# EAGLE schematic mimic1568_DtoA (EAGLE 7.5.0)
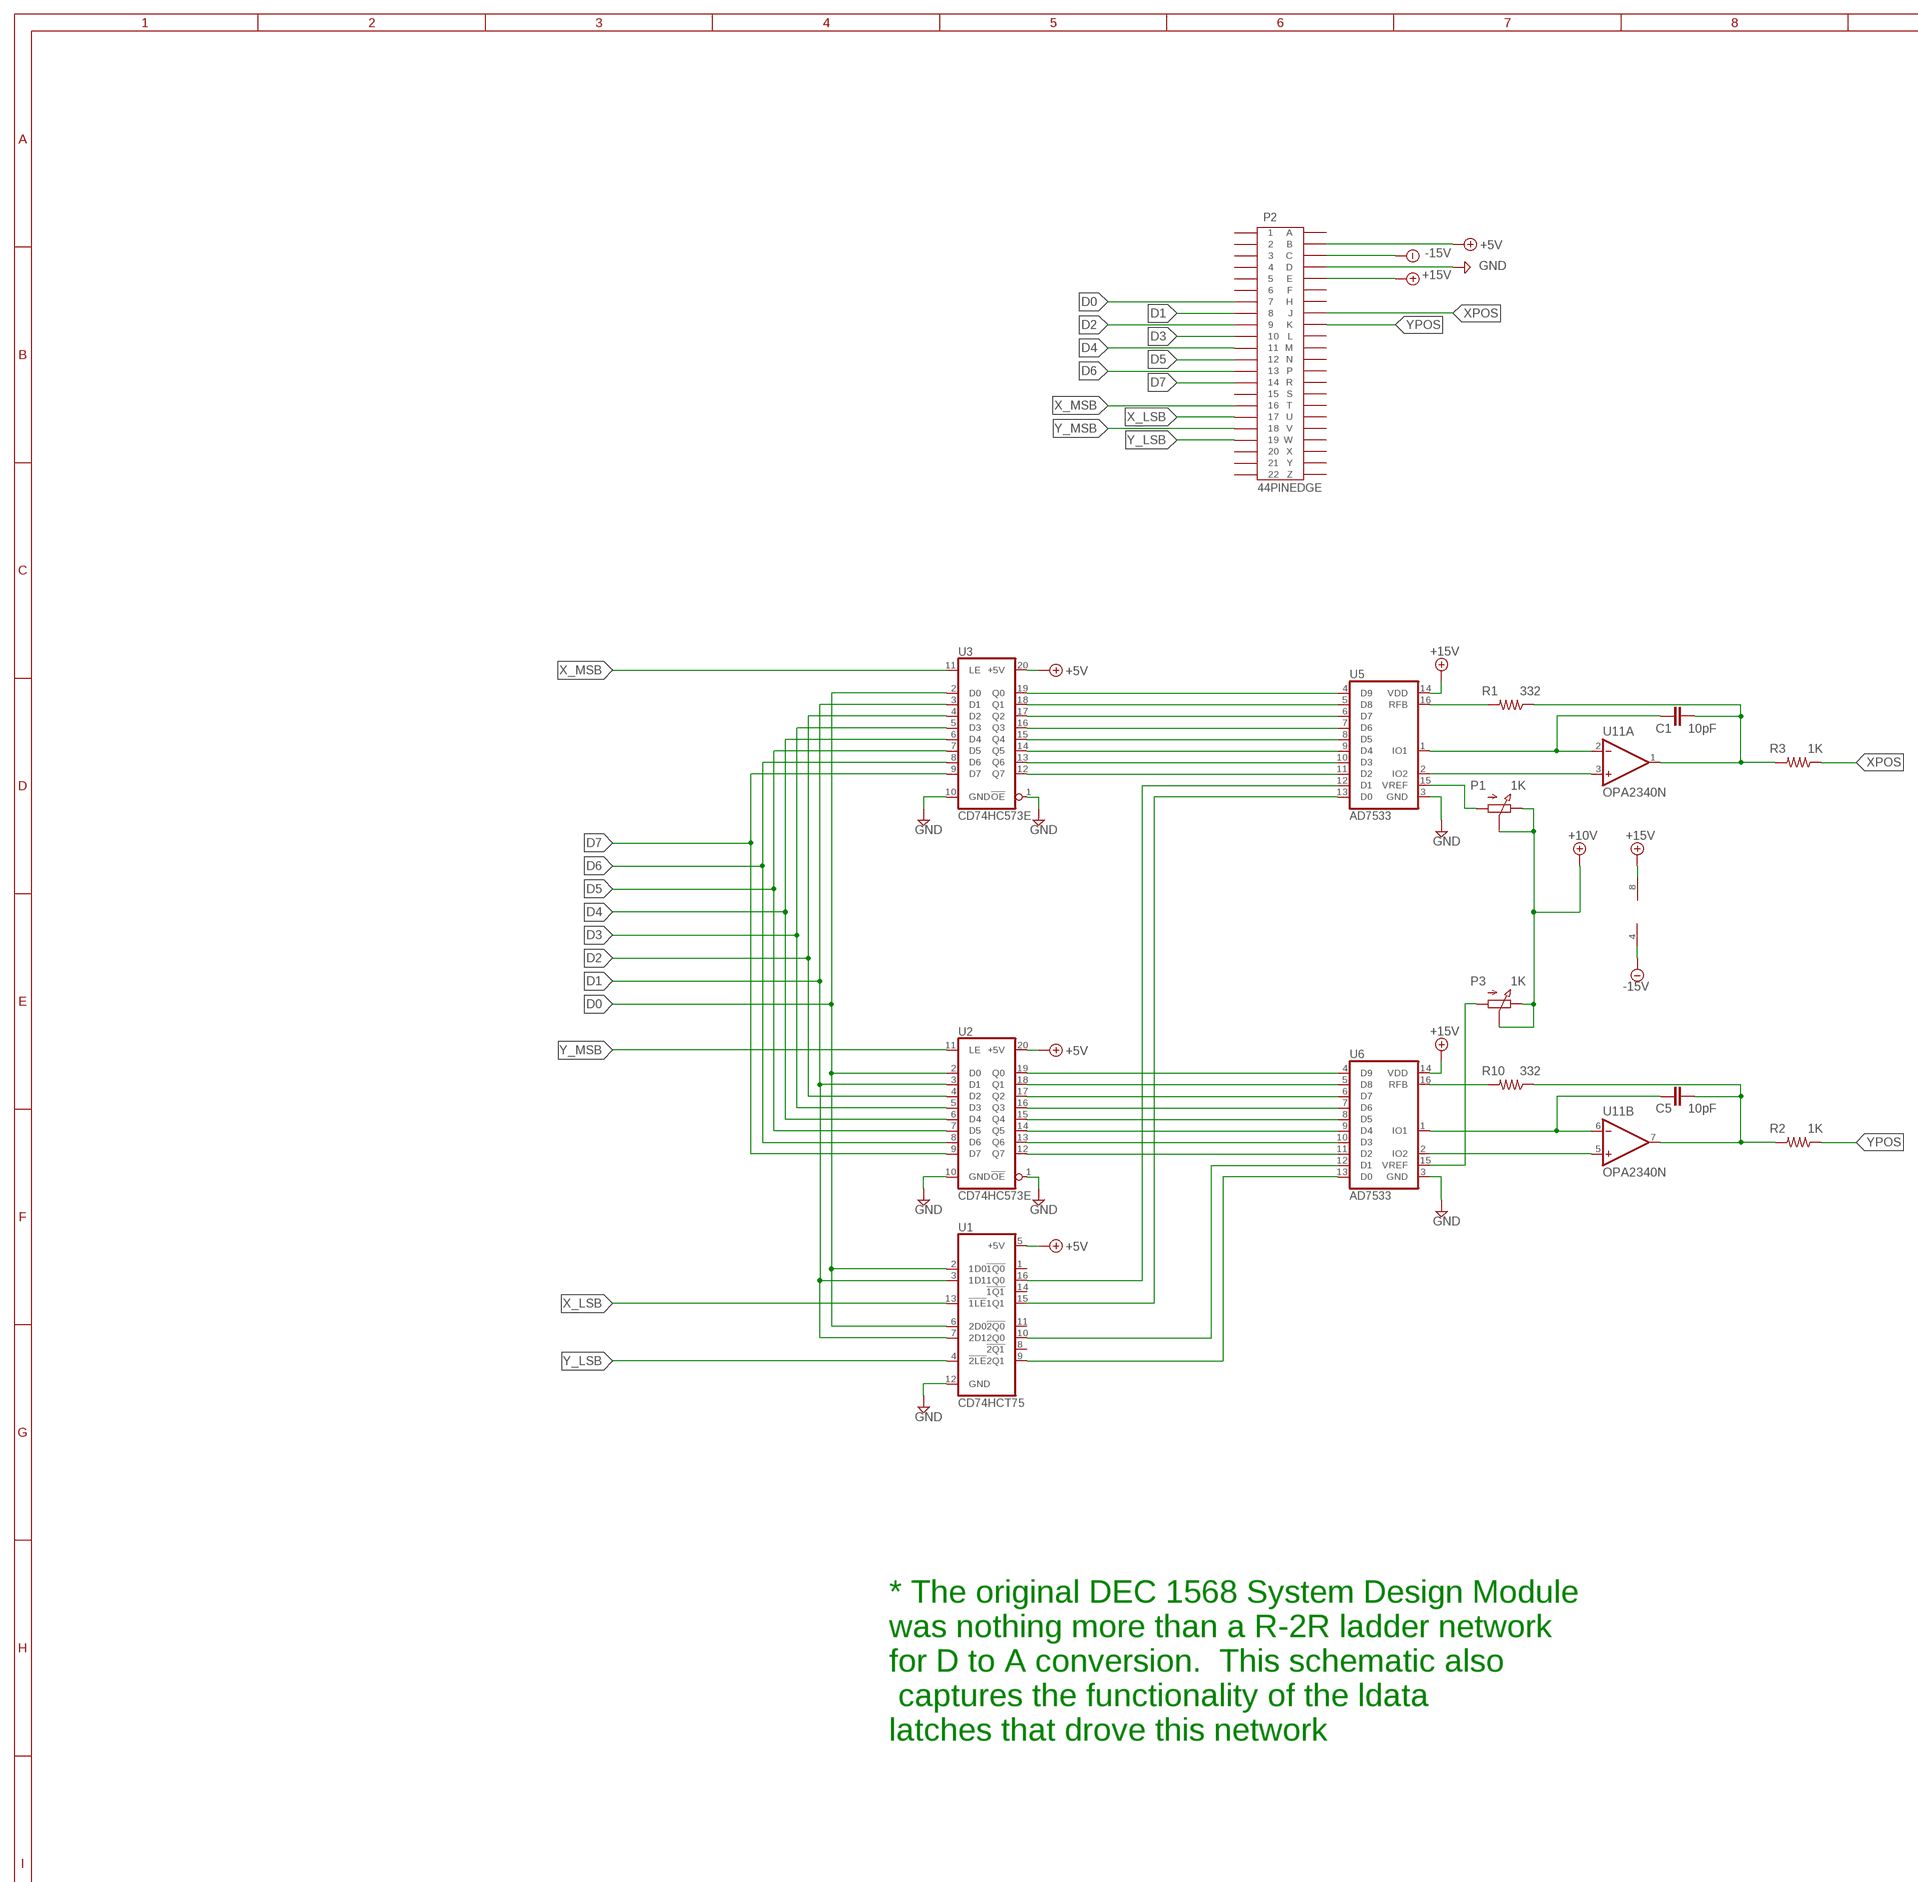
[diagram p0: schematic, sheet 1, part 1 of 2]
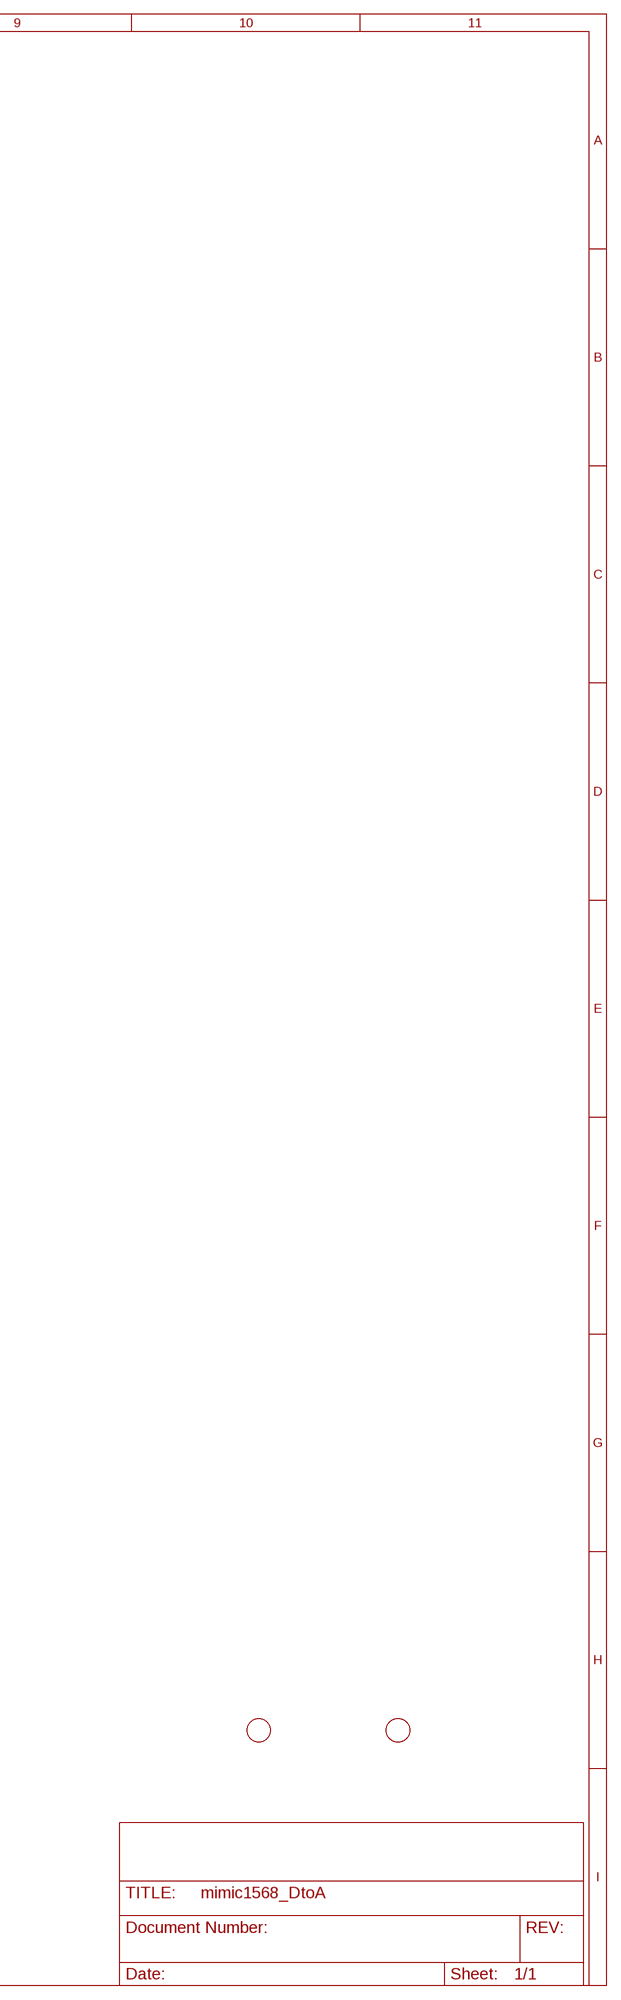
[diagram p1: schematic, sheet 1, part 2 of 2]

## Parts
C1  10pF  C-0.1  [C2.5]
C5  10pF  C-0.1  [C2.5]
P1  1K  POT-3006P  [3006P]
P2  44PINEDGE  [44PINEDGE]
P3  1K  POT-3006P  [3006P]
R1  332  R-1/4WATT  [0207/10]
R2  1K  R-1/4WATT  [0207/10]
R3  1K  R-1/4WATT  [0207/10]
R10  332  R-1/4WATT  [0207/10]
U1  CD74HCT75  [DIP-16]
U2  CD74HC573E  [DIP-20]
U3  CD74HC573E  [DIP-20]
U5  AD7533  [DIP-16]
U6  AD7533  [DIP-16]
U11  OPA2340N  [DIP-08]
U$1  FIDUCIAL  [FIDUCIAL_1MM]
U$2  FIDUCIAL  [FIDUCIAL_1MM]

## Nets
+5V: P2.B U1.5(+5V) U2.20(+5V) U3.20(+5V)
+10V: P1.2(S) P1.3(E) P3.2(S) P3.3(E)
+15V: P2.E U5.14(VDD) U6.14(VDD) U11.8(P:V+)
-15V: P2.C U11.4(P:V-)
D0: P2.7 U1.2(1D0) U1.6(2D0) U2.2(D0) U3.2(D0)
D1: P2.8 U1.3(1D1) U1.7(2D1) U2.3(D1) U3.3(D1)
D2: P2.9 U2.4(D2) U3.4(D2)
D3: P2.10 U2.5(D3) U3.5(D3)
D4: P2.11 U2.6(D4) U3.6(D4)
D5: P2.12 U2.7(D5) U3.7(D5)
D6: P2.13 U2.8(D6) U3.8(D6)
D7: P2.14 U2.9(D7) U3.9(D7)
GND: P2.D U1.12(GND) U2.1(!OE) U2.10(GND) U3.1(!OE) U3.10(GND) U5.3(GND) U6.3(GND)
N$1: U1.9(2Q1) U6.13(D0)
N$3: U1.16(1Q0) U5.12(D1)
N$4: U1.15(1Q1) U5.13(D0)
N$5: C1.1 U5.1(IO1) U11.2(A:-IN)
N$6: U5.2(IO2) U11.3(A:+IN)
N$7: U2.19(Q0) U6.4(D9)
N$8: U2.18(Q1) U6.5(D8)
N$9: U2.17(Q2) U6.6(D7)
N$10: U2.16(Q3) U6.7(D6)
N$11: U2.15(Q4) U6.8(D5)
N$12: U2.14(Q5) U6.9(D4)
N$13: U2.13(Q6) U6.10(D3)
N$14: U2.12(Q7) U6.11(D2)
N$23: C1.2 R1.1 R3.2 U11.1(A:OUT)
N$24: P1.1(A) U5.15(VREF)
N$25: U3.19(Q0) U5.4(D9)
N$26: U3.18(Q1) U5.5(D8)
N$27: U3.17(Q2) U5.6(D7)
N$28: U3.16(Q3) U5.7(D6)
N$29: U3.15(Q4) U5.8(D5)
N$30: U3.14(Q5) U5.9(D4)
N$31: U3.13(Q6) U5.10(D3)
N$32: U3.12(Q7) U5.11(D2)
N$35: U1.10(2Q0) U6.12(D1)
N$38: R1.2 U5.16(RFB)
N$44: C5.2 R2.2 R10.1 U11.7(B:OUT)
N$45: C5.1 U6.1(IO1) U11.6(B:-IN)
N$46: U6.2(IO2) U11.5(B:+IN)
N$47: R10.2 U6.16(RFB)
N$53: P3.1(A) U6.15(VREF)
X_LSB: P2.17 U1.13(!1LE)
X_MSB: P2.16 U3.11(LE)
XPOS: P2.J R3.1
Y_LSB: P2.19 U1.4(!2LE)
Y_MSB: P2.18 U2.11(LE)
YPOS: P2.K R2.1
Unconnected: P2.1 P2.2 P2.3 P2.4 P2.5 P2.6 P2.15 P2.20 P2.21 P2.22 P2.A P2.F P2.H P2.L P2.M P2.N P2.P P2.R P2.S P2.T P2.U P2.V P2.W P2.X P2.Y P2.Z U1.1(!1Q0) U1.8(!2Q1) U1.11(!2Q0) U1.14(!1Q1)

## Notes on the sheet
- * The original DEC 1568 System Design Module 
  was nothing more than a R-2R ladder network 
  for D to A conversion.  This schematic also
   captures the functionality of the ldata 
  latches that drove this network

## Library data of the parts
C1 C5 = keiths:C-0.1: Through hole radial capacitor. 0.1 inch lead to lead.
P1 P3 = keiths:POT-3006P: 3006 - Trimpot® Trimming Potentiometer. Clockwise turn moves wiper to pin 3; PN: 3006W-1-102LF
P2 = keiths:44PINEDGE: 44 PIN EDGE CONNECTOR FOR PCB
R1-R3 R10 = keiths:R-1/4WATT: Quarter watt through hole resistor.
U1 = keiths:CD74HCT75: dual two bit transparant latch
U2 U3 = keiths:CD74HC573E: Octal Transparent D-Type Latches With 3-State Outputs
U5 U6 = keiths:AD7533: CMOS parallel input 10-Bit Multiplying DAC
U11 = keiths:OPA2340: SINGLE-SUPPLY, RAIL-TO-RAIL OP AMPS 5.5MHz; PN: OPA2340PA
U$1 U$2 = adafruit:FIDUCIAL: For use by pick and place machines to calibrate the vision/machine, 1mm By microbuilder.eu